# EAGLE schematic display (EAGLE 7.1.0)
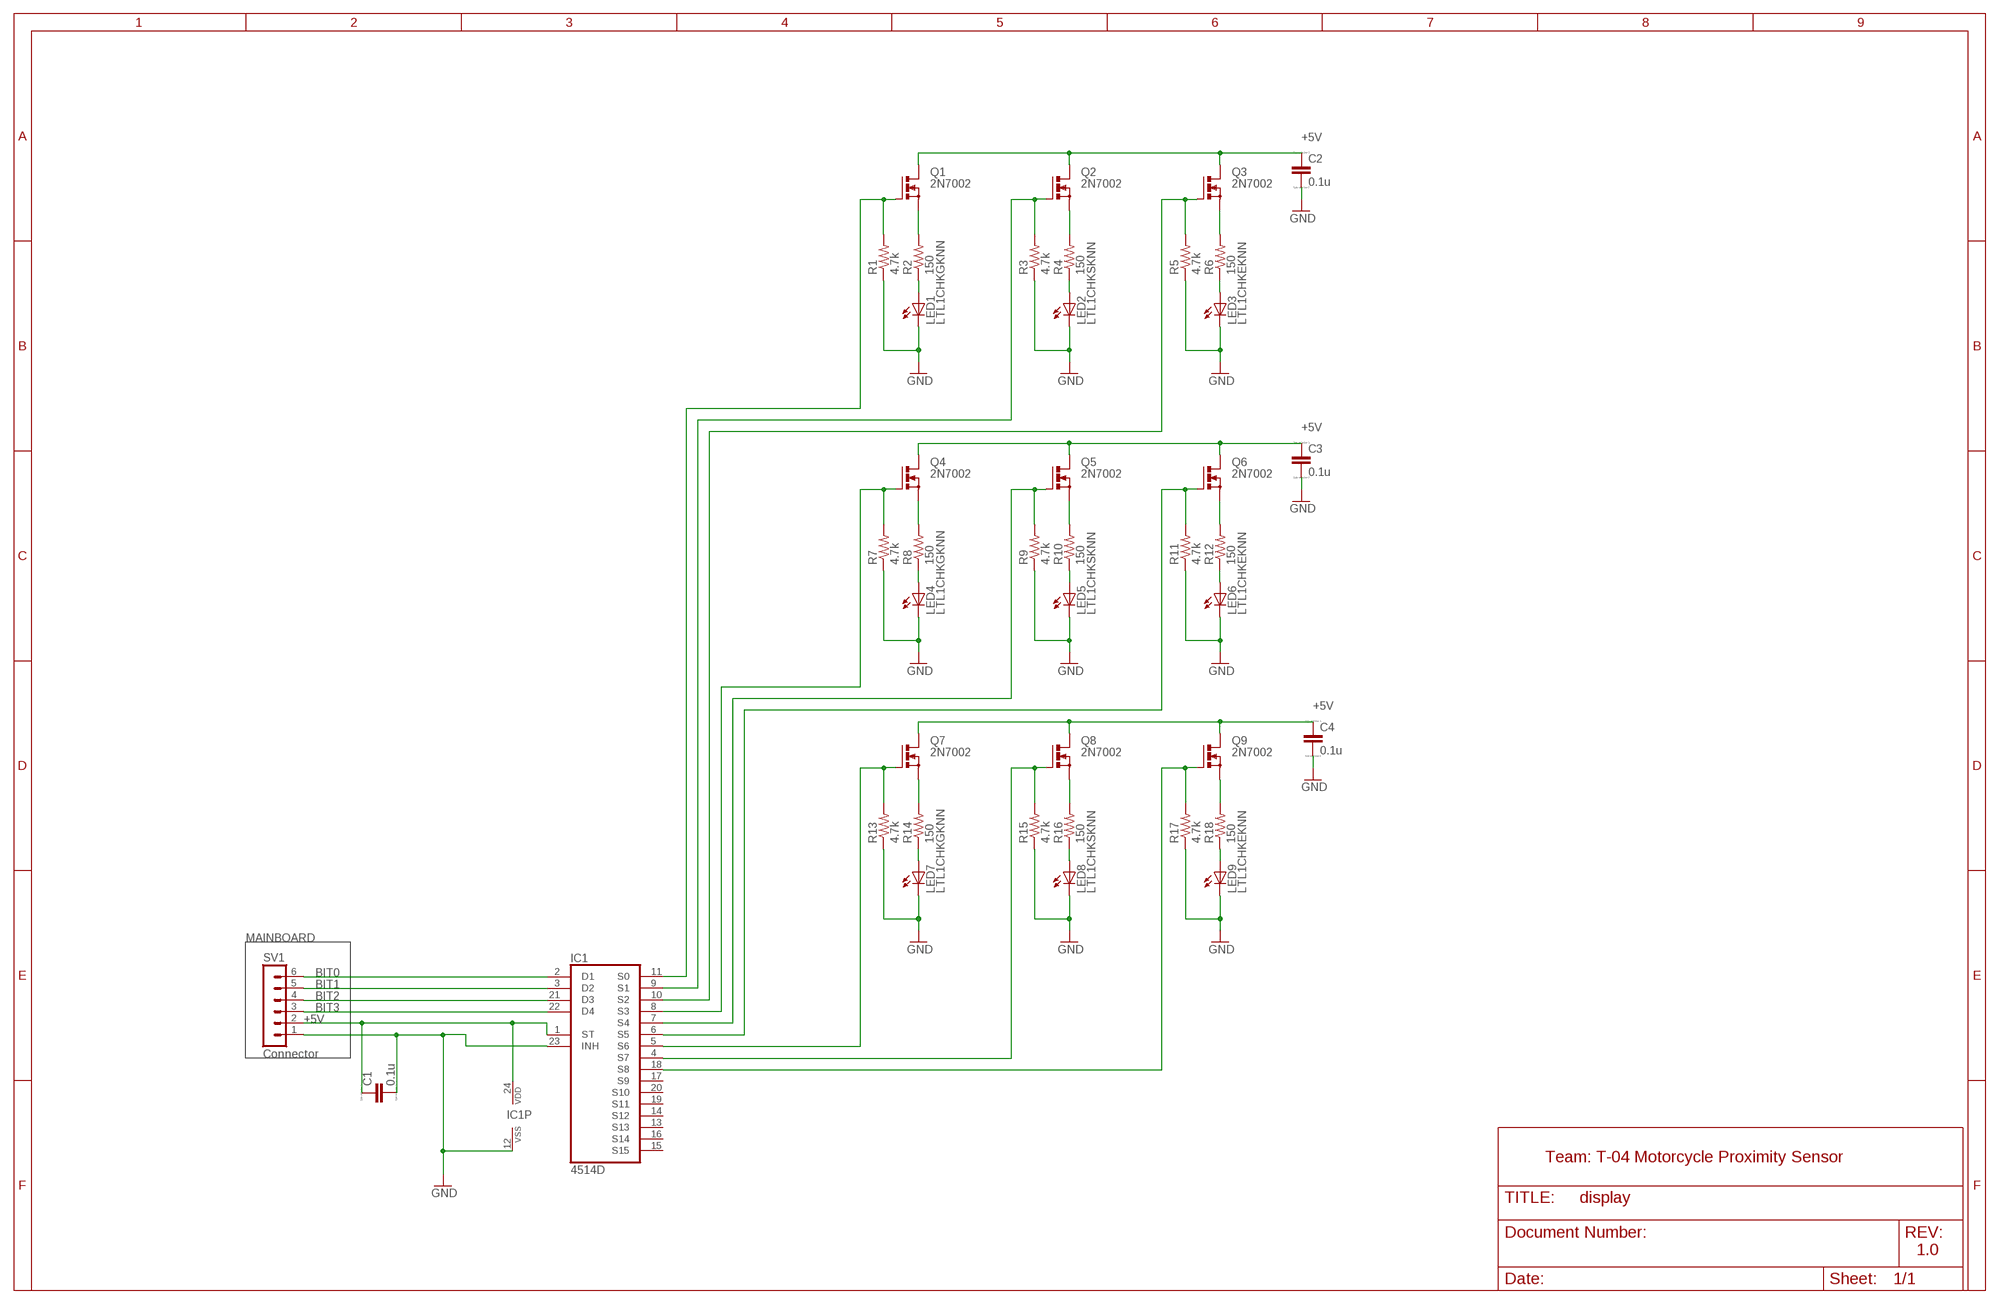
[diagram p0: schematic, sheet 1]

## Parts
C1  0.1u  CC3216  [C3216]
C2  0.1u  CC3216  [C3216]
C3  0.1u  CC3216  [C3216]
C4  0.1u  CC3216  [C3216]
IC1  4514D  [SO24W]
LED1  LTL1CHKGKNN  LEDSMT1206  [1206]
LED2  LTL1CHKSKNN  LEDSMT1206  [1206]
LED3  LTL1CHKEKNN  LEDSMT1206  [1206]
LED4  LTL1CHKGKNN  LEDSMT1206  [1206]
LED5  LTL1CHKSKNN  LEDSMT1206  [1206]
LED6  LTL1CHKEKNN  LEDSMT1206  [1206]
LED7  LTL1CHKGKNN  LEDSMT1206  [1206]
LED8  LTL1CHKSKNN  LEDSMT1206  [1206]
LED9  LTL1CHKEKNN  LEDSMT1206  [1206]
Q1  2N7002  BUZ11BV  [TO220BV]
Q2  2N7002  BUZ11BV  [TO220BV]
Q3  2N7002  BUZ11BV  [TO220BV]
Q4  2N7002  BUZ11BV  [TO220BV]
Q5  2N7002  BUZ11BV  [TO220BV]
Q6  2N7002  BUZ11BV  [TO220BV]
Q7  2N7002  BUZ11BV  [TO220BV]
Q8  2N7002  BUZ11BV  [TO220BV]
Q9  2N7002  BUZ11BV  [TO220BV]
R1  4.7k  R-US_M3516  [M3516]
R2  150  R-US_M3516  [M3516]
R3  4.7k  R-US_M3516  [M3516]
R4  150  R-US_M3516  [M3516]
R5  4.7k  R-US_M3516  [M3516]
R6  150  R-US_M3516  [M3516]
R7  4.7k  R-US_M3516  [M3516]
R8  150  R-US_M3516  [M3516]
R9  4.7k  R-US_M3516  [M3516]
R10  150  R-US_M3516  [M3516]
R11  4.7k  R-US_M3516  [M3516]
R12  150  R-US_M3516  [M3516]
R13  4.7k  R-US_M3516  [M3516]
R14  150  R-US_M3516  [M3516]
R15  4.7k  R-US_M3516  [M3516]
R16  150  R-US_M3516  [M3516]
R17  4.7k  R-US_M3516  [M3516]
R18  150  R-US_M3516  [M3516]
SV1  Connector  MA06-1  [MA06-1]

## Nets
+5V: C1.1 C2.1 C3.1 C4.1 IC1.1(ST) IC1.24(VDD) Q1.D Q2.D Q3.D Q4.D Q5.D Q6.D Q7.D Q8.D Q9.D SV1.2
BIT0: IC1.2(D1) SV1.6
BIT1: IC1.3(D2) SV1.5
BIT2: IC1.21(D3) SV1.4
BIT3: IC1.22(D4) SV1.3
GND: C1.2 C2.2 C3.2 C4.2 IC1.12(VSS) IC1.23(INH) LED1.C LED2.C LED3.C LED4.C LED5.C LED6.C LED7.C LED8.C LED9.C R1.1 R3.1 R5.1 R7.1 R9.1 R11.1 R13.1 R15.1 R17.1 SV1.1
N$1: Q1.S R2.2
N$2: Q2.S R4.2
N$3: Q3.S R6.2
N$8: LED1.A R2.1
N$9: LED3.A R6.1
N$12: LED2.A R4.1
N$13: Q4.S R8.2
N$14: Q5.S R10.2
N$15: Q6.S R12.2
N$16: LED5.A R10.1
N$17: LED4.A R8.1
N$20: LED6.A R12.1
N$21: Q7.S R14.2
N$24: Q8.S R16.2
N$26: Q9.S R18.2
N$27: LED9.A R18.1
N$28: LED8.A R16.1
N$29: LED7.A R14.1
N$36: IC1.11(S0) Q1.G R1.2
N$37: IC1.9(S1) Q2.G R3.2
N$38: IC1.10(S2) Q3.G R5.2
N$39: IC1.8(S3) Q4.G R7.2
N$40: IC1.7(S4) Q5.G R9.2
N$41: IC1.6(S5) Q6.G R11.2
N$42: IC1.5(S6) Q7.G R13.2
N$43: IC1.4(S7) Q8.G R15.2
N$44: IC1.18(S8) Q9.G R17.2
Unconnected: IC1.13(S13) IC1.14(S12) IC1.15(S15) IC1.16(S14) IC1.17(S9) IC1.19(S11) IC1.20(S10)

## Notes on the sheet
- MAINBOARD
- Team: T-04 Motorcycle Proximity Sensor
- 1.0

## Library data of the parts
C1-C4 = eagle-ltspice:C: CAPACITOR, European symbol; SPICEMODEL: NONE; SPICEPREFIX: C
IC1 = 45xx:4514: 4-bit latch 4-16 line DECODER
LED1-LED9 = led:LED: LED OSRAM: - CHIPLED LG R971, LG N971, LY N971, LG Q971, LY Q971, LO R971, LY R971 LH N974, LH R974 LS Q976, LO Q976, LY Q976 LO Q996 - Hyper CHIPLED LW Q18S LB Q993, LB Q99A, LB R99A - SideLED LS A670, LO A670, LY A670, LG A670, LP A670 LB A673, LV A673, LT A673, LW A673 LH A674 LY A675 LS A676, LA A676, LO A676, LY A676, LW A676 LS A679, LY A679, LG A679 - Hyper Micro SIDELED® LS Y876, LA Y876, LO Y876, LY Y876 LT Y87S - SmartLED LW L88C, LW L88S LB L89C, LB L89S, LG L890 LS L89K, LO L89K, LY L89K LS L896, LA L896, LO L896, LY L896 - TOPLED LS T670, LO T670, LY T670, LG T670, LP T670 LSG T670, LSP T670, LSY T670, LOP T670, LYG T670 LG T671, LOG T671, LSG T671 LB T673, LV T673, LT T673, LW T673 LH T674 LS T676, LA T676, LO T676, LY T676, LB T676, LH T676, LSB T676, LW T676 LB T67C, LV T67C, LT T67C, LS T67K, LO T67K, LY T67K, LW E67C LS E67B, LA E67B, LO E67B, LY E67B, LB E67C, LV E67C, LT E67C LW T67C LS T679, LY T679, LG T679 LS T770, LO T770, LY T770, LG T770, LP T770 LB T773, LV T773, LT T773, LW T773 LH T774 LS E675, LA E675, LY E675, LS T675 LS T776, LA T776, LO T776, LY T776, LB T776 LHGB T686 LT T68C, LB T68C - Hyper Mini TOPLED® LB M676 - Mini TOPLED Santana® LG M470 LS M47K, LO M47K, LY M47K Source: http://www.osram.convergy.de LUXEON: - LUMILED® LXK2-PW12-R00, LXK2-PW12-S00, LXK2-PW14-U00, LXK2-PW14-V00 LXK2-PM12-R00, LXK2-PM12-S00, LXK2-PM14-U00 LXK2-PE12-Q00, LXK2-PE12-R00, LXK2-PE12-S00, LXK2-PE14-T00, LXK2-PE14-U00 LXK2-PB12-K00, LXK2-PB12-L00, LXK2-PB12-M00, LXK2-PB14-N00, LXK2-PB14-P00, LXK2-PB14-Q00 LXK2-PR12-L00, LXK2-PR12-M00, LXK2-PR14-Q00, LXK2-PR14-R00 LXK2-PD12-Q00, LXK2-PD12-R00, LXK2-PD12-S00 LXK2-PH12-R00, LXK2-PH12-S00 LXK2-PL12-P00, LXK2-PL12-Q00, LXK2-PL12-R00 Source: www.luxeon.com KINGBRIGHT: KA-3528ASYC Source: www.kingbright.com
Q1-Q9 = transistor-power:BUZ11: N-CHANNEL MOS FET
R1-R18 = resistor:R-US_: RESISTOR, American symbol
SV1 = con-lstb:MA06-1: PIN HEADER; OC_FARNELL: unknown; OC_NEWARK: unknown